# Altium schematic sheet T35_1_IO.SchDoc
size A4
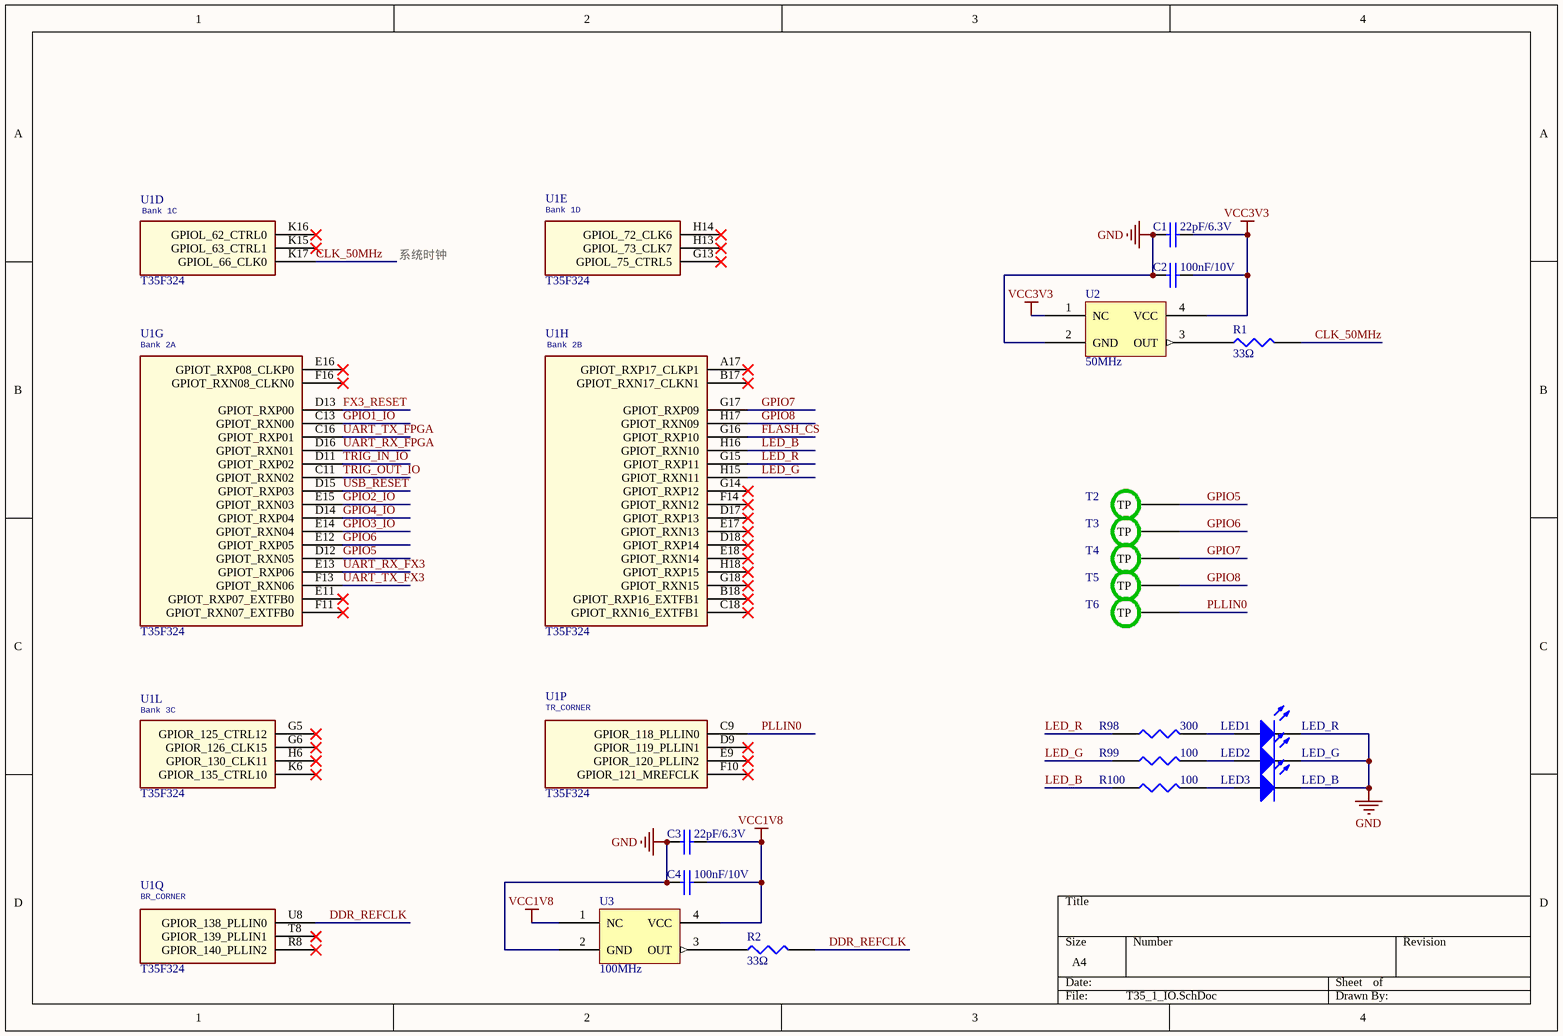
[diagram p0: T35_1_IO.SchDoc]

## Parts
C1  22pF/6.3V  [0201CS]
C2  100nF/10V  [0201CS]
C3  22pF/6.3V  [0201CS]
C4  100nF/10V  [0201CS]
LED1  LED_R  [0402LED]
LED2  LED_G  [0402LED]
LED3  LED_B  [0402LED]
R1  33Ω  [0402RS]
R2  33Ω  [0402RS]
R98  300  [0201RS]
R99  100  [0201RS]
R100  100  [0201RS]
T2  (no value)  [TP-S]
T3  (no value)  [TP-S]
T4  (no value)  [TP-S]
T5  (no value)  [TP-S]
T6  (no value)  [TP-S]
U1  T35F324  [T35-F324-BGA100P9X9-81A]  (parts D,E,G,H,L,P,Q of 17)
U2  50MHz  [XTAL_SMD_SMALL]
U3  100MHz  [XTAL_SMD_SMALL]

## Nets
GND: C1.1 C2.2 C3.1 C4.2 LED1.2(K) LED2.2(K) LED3.2(K) U2.2(GND) U3.2(GND)
VCC1V8: C3.2 C4.1 U3.1(NC) U3.4(VCC)
VCC3V3: C1.2 C2.1 U2.1(NC) U2.4(VCC)
CLK_50MHz: R1.2 U1.K17(GPIOL_66_CLK0)
DDR_REFCLK: R2.2 U1.U8(GPIOR_138_PLLIN0)
FLASH_CS: U1.G16(GPIOT_RXP10)
FX3_RESET: U1.D13(GPIOT_RXP00)
GPIO1_IO: U1.C13(GPIOT_RXN00)
GPIO2_IO: U1.E15(GPIOT_RXN03)
GPIO3_IO: U1.E14(GPIOT_RXN04)
GPIO4_IO: U1.D14(GPIOT_RXP04)
GPIO5: T2.1(TP) U1.D12(GPIOT_RXN05)
GPIO6: T3.1(TP) U1.E12(GPIOT_RXP05)
GPIO7: T4.1(TP) U1.G17(GPIOT_RXP09)
GPIO8: T5.1(TP) U1.H17(GPIOT_RXN09)
LED_B: R100.1 U1.H16(GPIOT_RXN10)
LED_G: R99.1 U1.H15(GPIOT_RXN11)
LED_R: R98.1 U1.G15(GPIOT_RXP11)
PLLIN0: T6.1(TP) U1.C9(GPIOR_118_PLLIN0)
TRIG_IN_IO: U1.D11(GPIOT_RXP02)
TRIG_OUT_IO: U1.C11(GPIOT_RXN02)
UART_RX_FPGA: U1.D16(GPIOT_RXN01)
UART_RX_FX3: U1.E13(GPIOT_RXP06)
UART_TX_FPGA: U1.C16(GPIOT_RXP01)
UART_TX_FX3: U1.F13(GPIOT_RXN06)
USB_RESET: U1.D15(GPIOT_RXP03)
NetLED1_1: LED1.1(A) R98.2
NetLED2_1: LED2.1(A) R99.2
NetLED3_1: LED3.1(A) R100.2
NetR1_1: R1.1 U2.3(OUT)
NetR2_1: R2.1 U3.3(OUT)

Not connected (* = marked no-connect by the designer): U1 A17(GPIOT_RXP17_CLKP1)* B17(GPIOT_RXN17_CLKN1)* B18(GPIOT_RXP16_EXTFB1)* C18(GPIOT_RXN16_EXTFB1)* D9(GPIOR_119_PLLIN1)* D17(GPIOT_RXP13)* D18(GPIOT_RXP14)* E9(GPIOR_120_PLLIN2)* E11(GPIOT_RXP07_EXTFB0)* E16(GPIOT_RXP08_CLKP0)* E17(GPIOT_RXN13)* E18(GPIOT_RXN14)* F10(GPIOR_121_MREFCLK)* F11(GPIOT_RXN07_EXTFB0)* F14(GPIOT_RXN12)* F16(GPIOT_RXN08_CLKN0)* G5(GPIOR_125_CTRL12)* G6(GPIOR_126_CLK15)* G13(GPIOL_75_CTRL5)* G14(GPIOT_RXP12)* G18(GPIOT_RXN15)* H6(GPIOR_130_CLK11)* H13(GPIOL_73_CLK7)* H14(GPIOL_72_CLK6)* H18(GPIOT_RXP15)* K6(GPIOR_135_CTRL10)* K15(GPIOL_63_CTRL1)* K16(GPIOL_62_CTRL0)* R8(GPIOR_140_PLLIN2)* T8(GPIOR_139_PLLIN1)*

## Notes on the sheet
- 系统时钟
- (in symbol T35F324, part D) Bank 1C
- (in symbol T35F324, part E) Bank 1D
- (in symbol T35F324, part G) Bank 2A
- (in symbol T35F324, part H) Bank 2B
- (in symbol T35F324, part L) Bank 3C
- (in symbol T35F324, part P) TR_CORNER
- (in symbol T35F324, part Q) BR_CORNER

## Library data of the parts
C1 C3 = CAP: 贴片电容; Value: 22pF ±5% 50V
C2 C4 = CAP: 贴片电容; Value: 0.1uF ±10% 16V; ComponentLink1Description: Link; ComponentLink1URL: https://item.szlcsc.com/456838.html
LED1 = LED1: 红色LED; Published: 8-Jun-2000; LatestRevisionDate: 08-Jul-2005; LatestRevisionNote: Mech Layer 1 removed.; PackageReference: LED-1; Publisher: Altium Limited; Link: https://item.szlcsc.com/142008.html
LED2 = LED1: 绿色LED; Published: 8-Jun-2000; LatestRevisionDate: 08-Jul-2005; LatestRevisionNote: Mech Layer 1 removed.; PackageReference: LED-1; Publisher: Altium Limited; Link: https://item.szlcsc.com/142012.html
LED3 = LED1: 蓝色LED; Published: 8-Jun-2000; LatestRevisionDate: 08-Jul-2005; LatestRevisionNote: Mech Layer 1 removed.; PackageReference: LED-1; Publisher: Altium Limited; Link: https://item.szlcsc.com/142013.html
R1 R2 = RES1: 贴片电阻; Value: 33Ω ±1%
R98-R100 = RES1: 贴片电阻; Value: 10K,±1%
T2-T6 = TP: 测试点; Value: 测试点
U1 = T35F324: FPGA芯片; SWAP_INFO: (S1+S2+S3+S4+S5+S6+S7+S8+S9+S10+S11+S12+S13+S14+S15+S16+S17); SPLIT_INST: TRUE
U2 U3 = 24LC00: 贴片有源晶振; Value: SIT8008BI-21-18N-72.000000